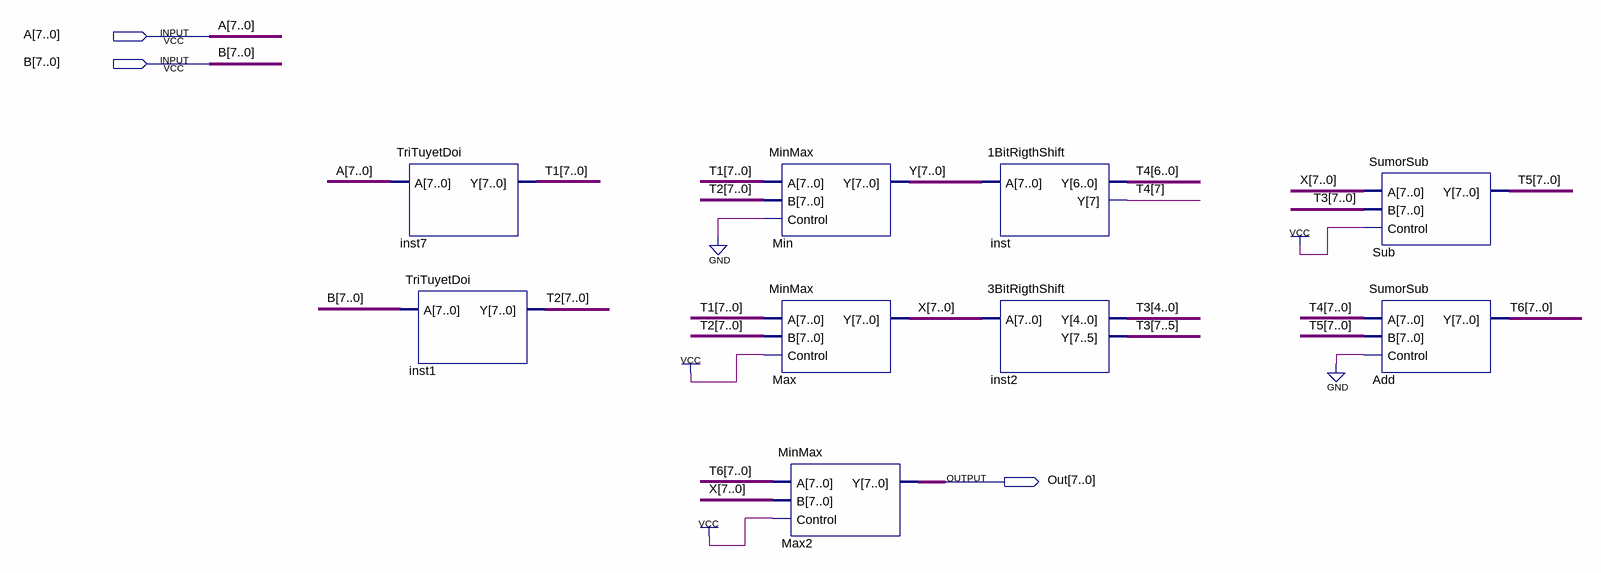
[diagram p0: schematic sheet]
// Quartus schematic Datapath.bdf as structural Verilog: 9 symbols, 3 pins
module Datapath (
  input  [7:0] A,
  input  [7:0] B,
  output [7:0] Out
);

  wire [7:0] T1, T2, T3, T4, T5, T6, X, Y;

  TriTuyetDoi inst7 (.A(A), .Y(T1));
  TriTuyetDoi inst1 (.A(B), .Y(T2));
  MinMax Min (.A(T1), .B(T2), .Control(1'b0), .Y(Y));
  MinMax Max (.A(T1), .B(T2), .Control(1'b1), .Y(X));
  MinMax Max2 (.A(T6), .B(X), .Control(1'b1), .Y(Out));
  \1BitRigthShift  inst (.A(Y), .Y(T4));
  \3BitRigthShift  inst2 (.A(X), .Y(T3));
  SumorSub Sub (.A(X), .B(T3), .Control(1'b1), .Y(T5));
  SumorSub Add (.A(T4), .B(T5), .Control(1'b0), .Y(T6));
endmodule
